# EasyEDA schematic CLIPPER CLAMPER PCB.json
TITLE: Sheet_1; REV: 1.0; Date: 2023-09-24; Sheet: 1/1; Drawn By: pv8821; Company: Your Company
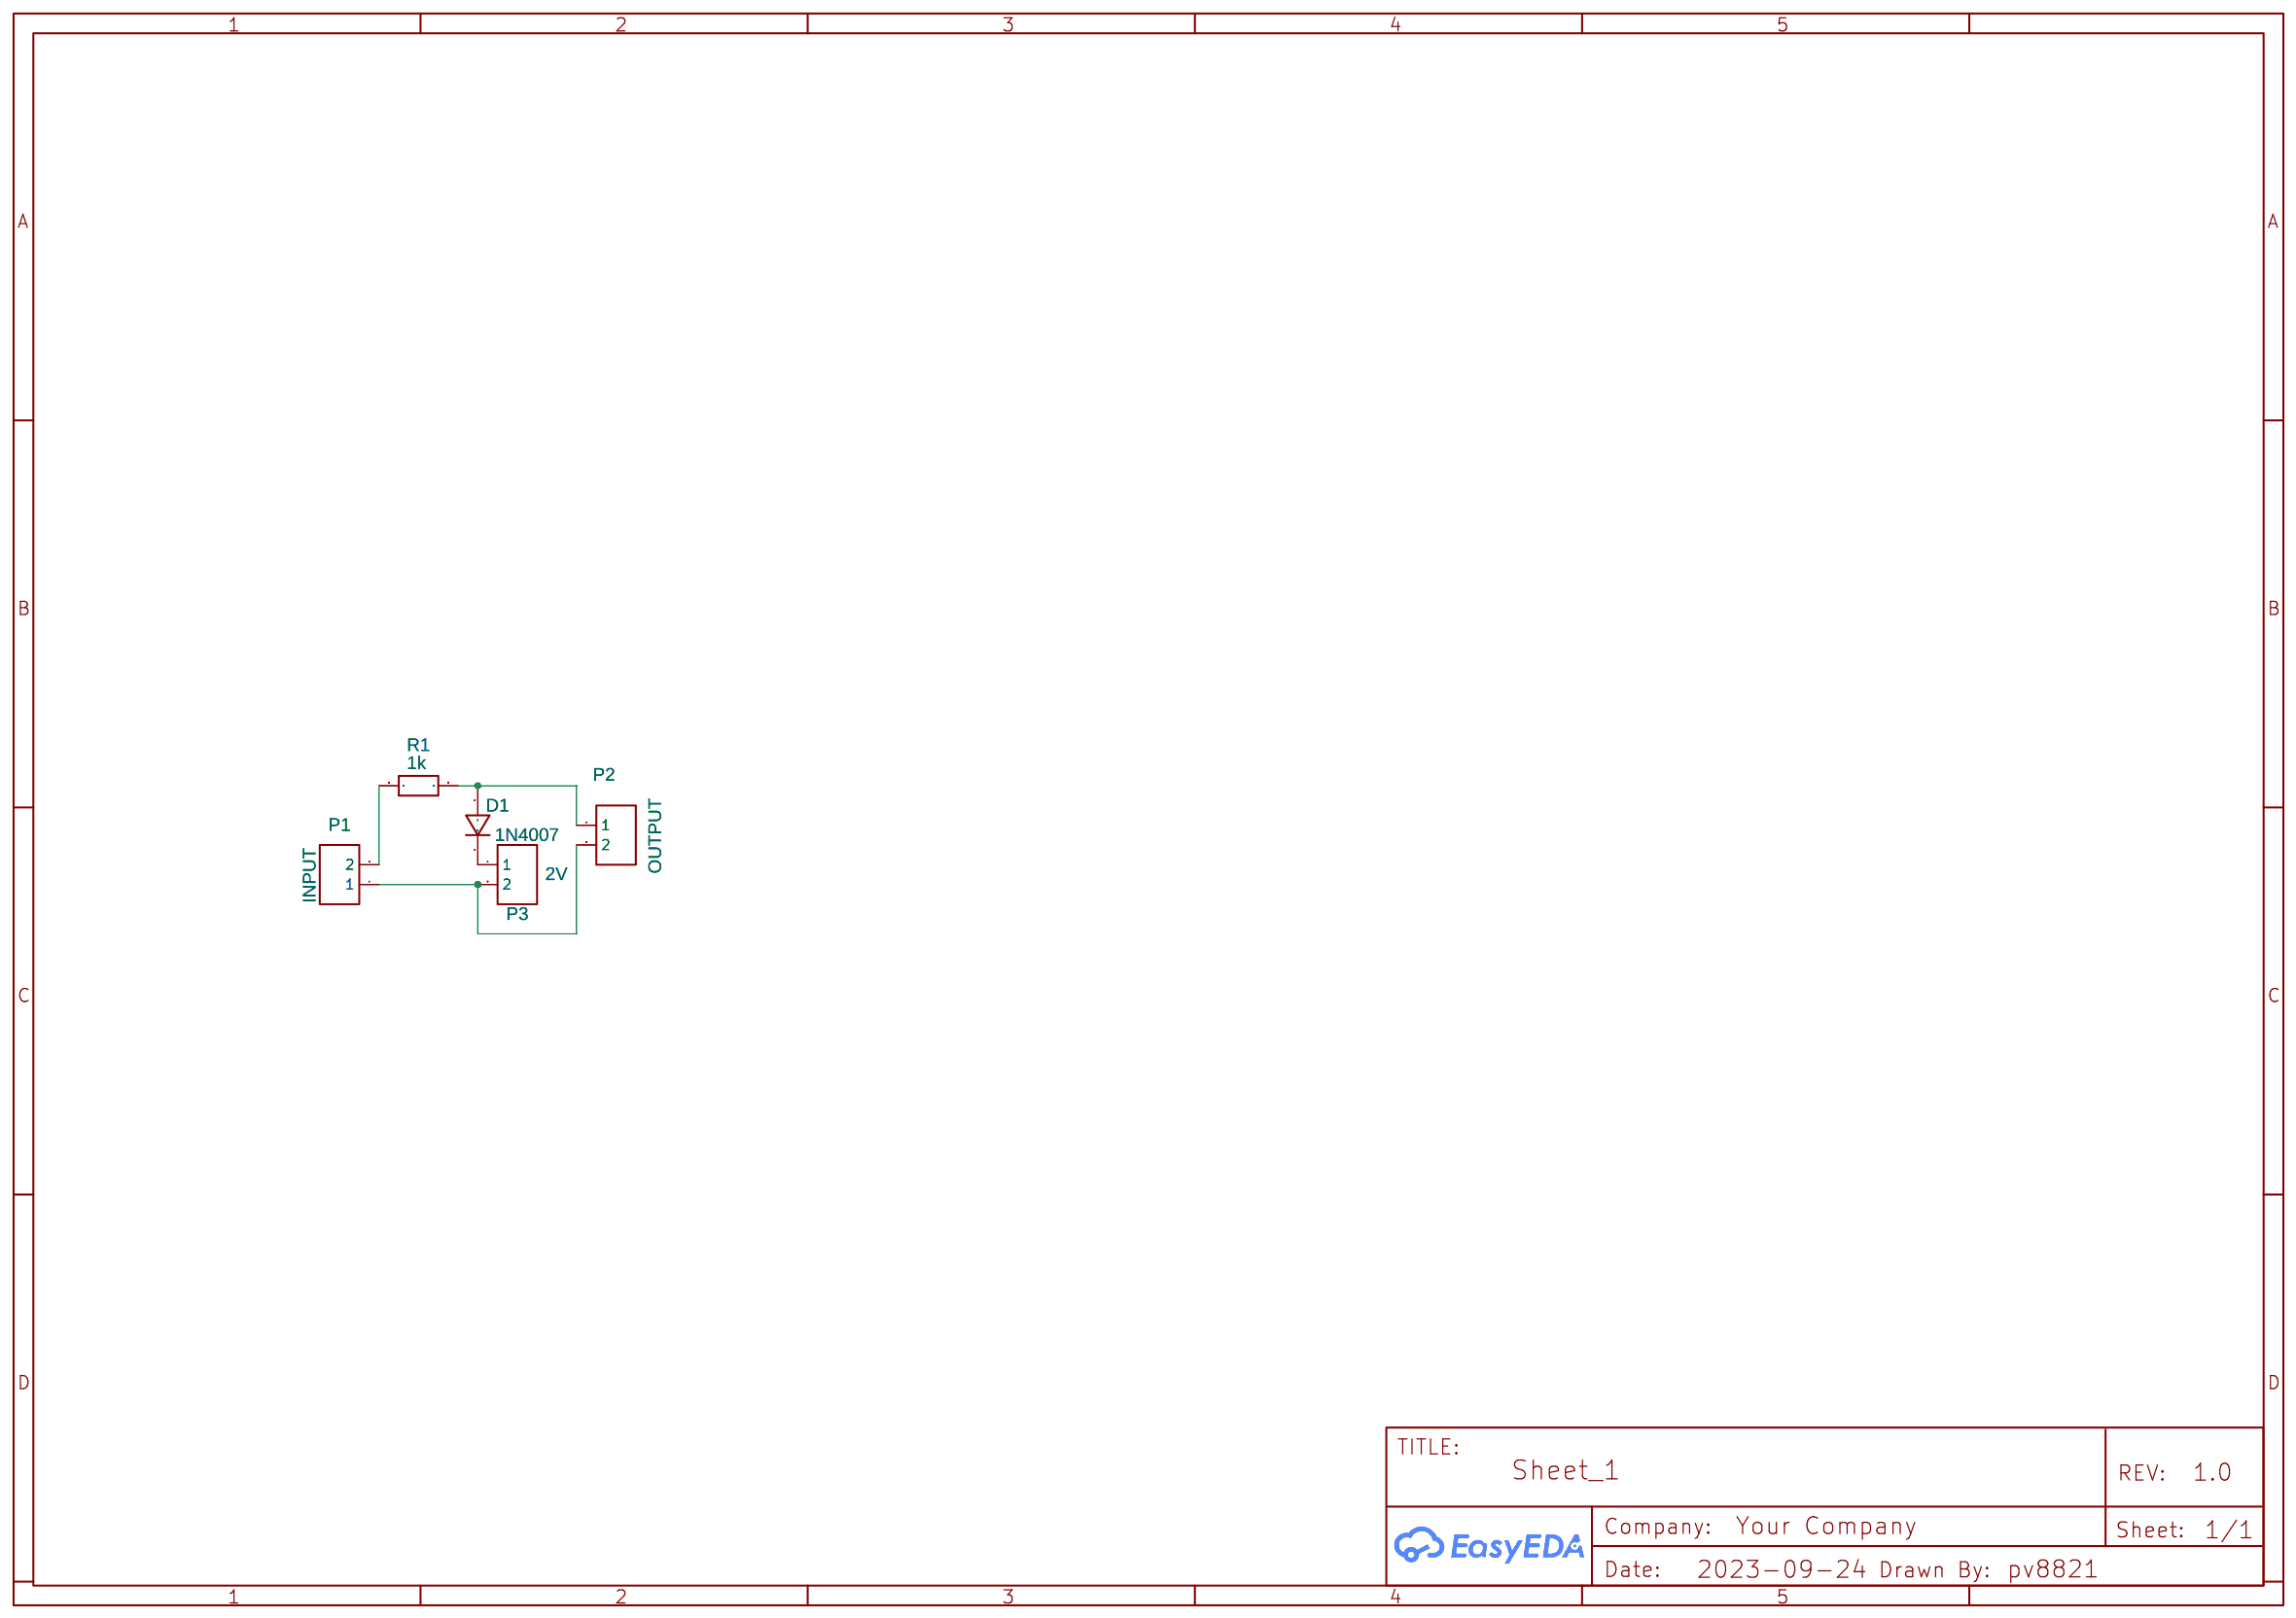
[diagram p0: schematic sheet]

## Parts
D1  1N4007  [DO-41_BD2.4-L4.7-P8.70-D0.9-RD]
P1  INPUT  [CONN-TH_2P-P5.00]
P2  OUTPUT  [CONN-TH_2P-P5.00]
P3  2V  [CONN-TH_2P-P5.00]
R1  1k  [R_AXIAL-0.5]

## Library data of the parts
D1 = 1N4007: Supplier: LCSC; Manufacturer: SEMTECH; Supplier Part: C106903; Contributor: LCEDA_Lib
P1-P3 = CONN-TH_2P-P5.00: Supplier: LCSC; Contributor: LCEDA_Lib
R1 = R_AXIAL-0.5_EU: Contributor: LCEDA_Lib

## Nets
Net-(D1-1): D1.1 P3.1
Net-(D1-2): D1.2 P2.1 R1.2
Net-(P1-1): P1.1 P2.2 P3.2
Net-(P1-2): P1.2 R1.1
